# EAGLE design DSP_PID (EAGLE 5.06)
PRICE: 10.00

## Sheet 1 of 2
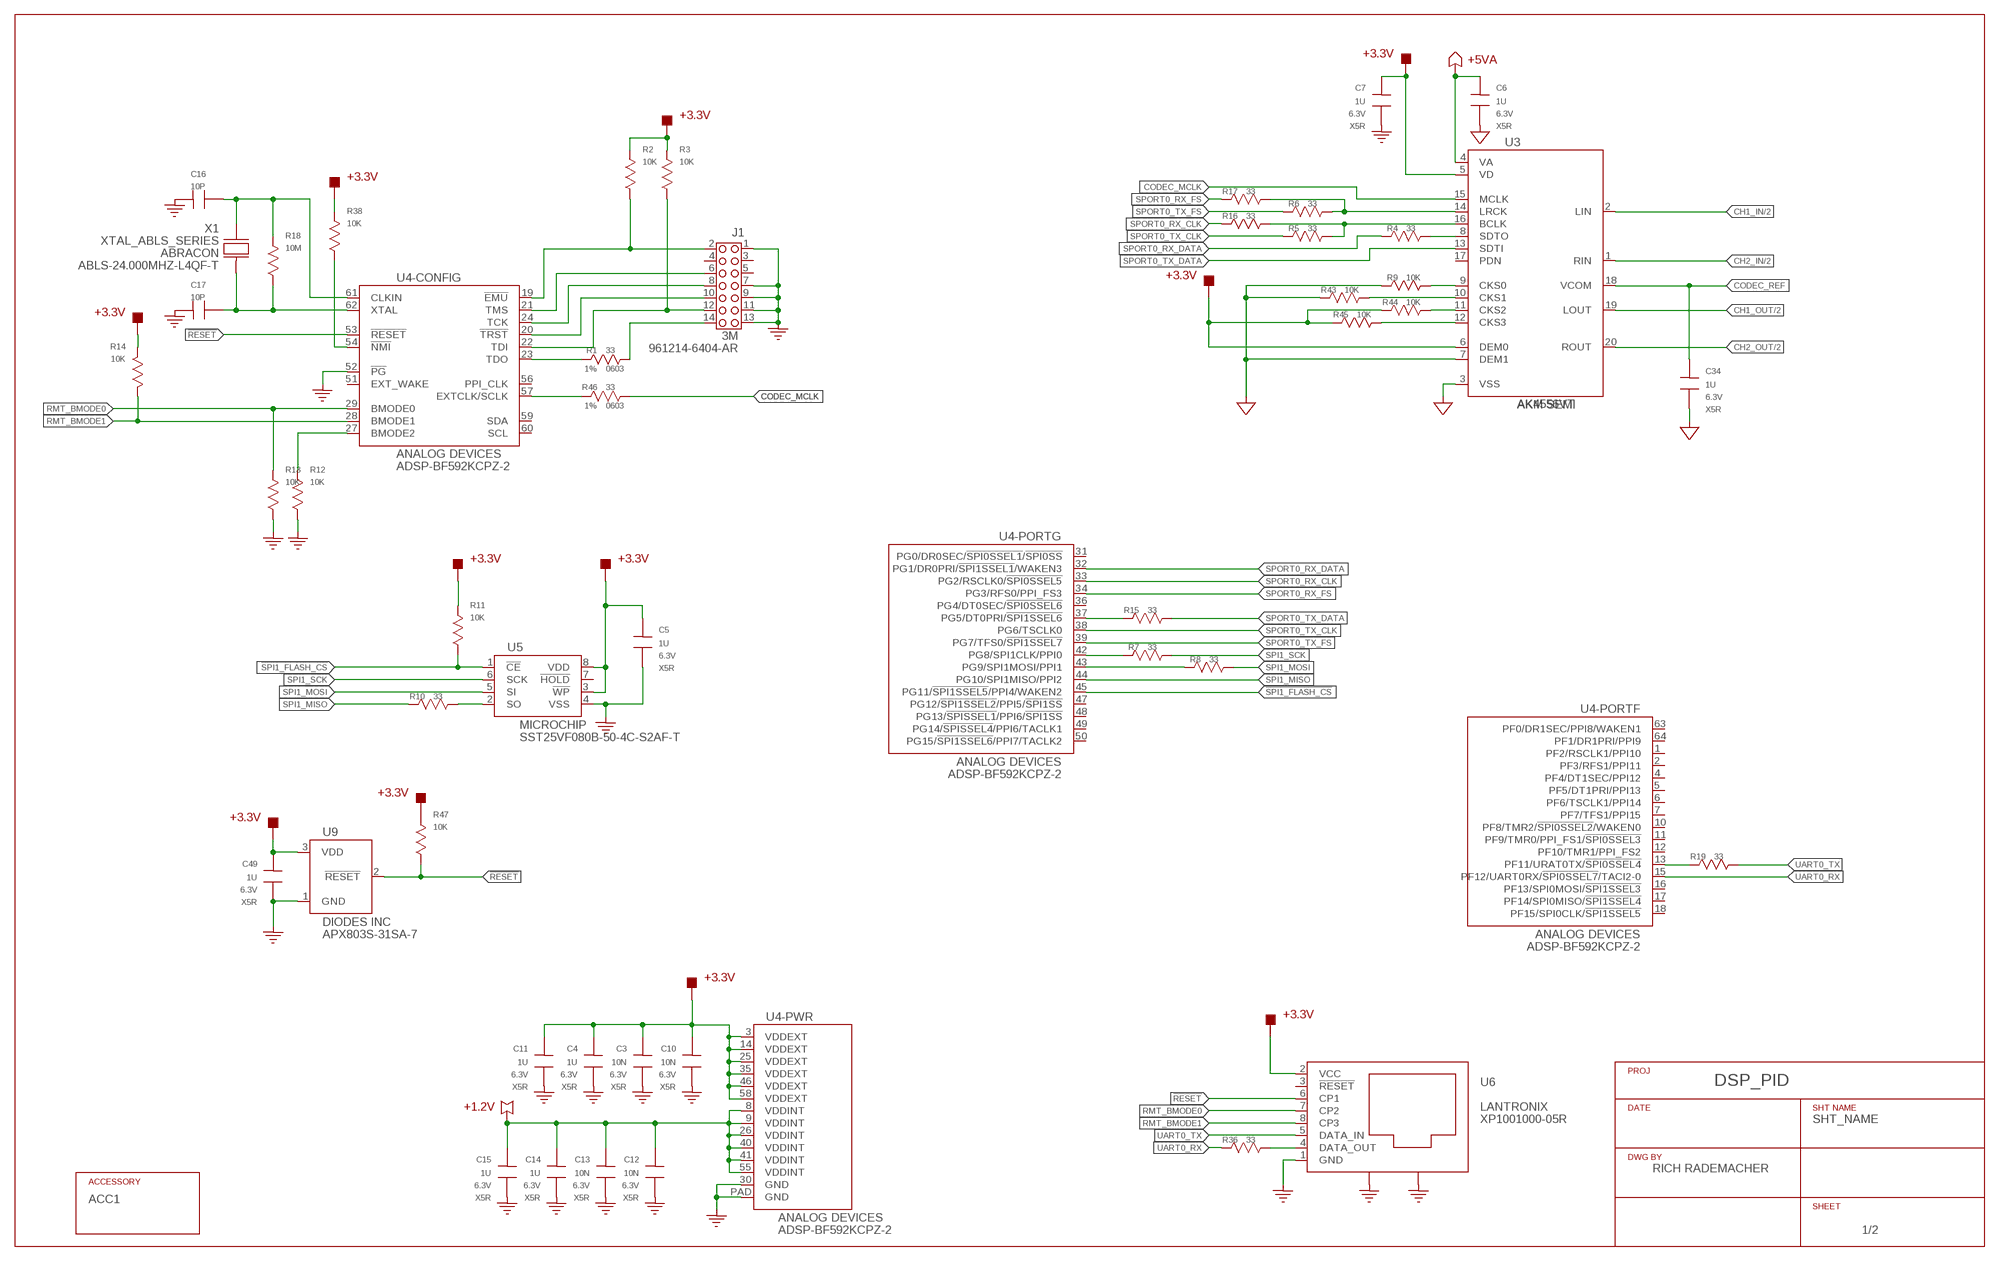
[diagram p0: schematic, sheet 1]
U$1 (TITLEBLOCK): AUTHOR: RICH RADEMACHER; DO_NOT_BOM: TRUE; SHT_NAME: SHT_NAME

### Parts
C3  10N  CAP-NP-0603  [R-0603]
C4  1U  CAP-NP-0603  [R-0603]
C5  1U  CAP-NP-0603  [R-0603]
C6  1U  CAP-NP-0603  [R-0603]
C7  1U  CAP-NP-0603  [R-0603]
C10  10N  CAP-NP-0603  [R-0603]
C11  1U  CAP-NP-0603  [R-0603]
C12  10N  CAP-NP-0603  [R-0603]
C13  10N  CAP-NP-0603  [R-0603]
C14  1U  CAP-NP-0603  [R-0603]
C15  1U  CAP-NP-0603  [R-0603]
C16  10P  CAP-NP-0603  [R-0603]
C17  10P  CAP-NP-0603  [R-0603]
C34  1U  CAP-NP-0603  [R-0603]
C49  1U  CAP-NP-0603  [R-0603]
J1  HDR_2X07X100  [2X07X0.100_HDR]
R1  33  RESISTOR-0603  [R-0603]
R2  10K  RESISTOR-0603  [R-0603]
R3  10K  RESISTOR-0603  [R-0603]
R4  33  RESISTOR-0603  [R-0603]
R5  33  RESISTOR-0603  [R-0603]
R6  33  RESISTOR-0603  [R-0603]
R7  33  RESISTOR-0603  [R-0603]
R8  33  RESISTOR-0603  [R-0603]
R9  10K  RESISTOR-0603  [R-0603]
R10  33  RESISTOR-0603  [R-0603]
R11  10K  RESISTOR-0603  [R-0603]
R12  10K  RESISTOR-0603  [R-0603]
R13  10K  RESISTOR-0603  [R-0603]
R14  10K  RESISTOR-0603  [R-0603]
R15  33  RESISTOR-0603  [R-0603]
R16  33  RESISTOR-0603  [R-0603]
R17  33  RESISTOR-0603  [R-0603]
R18  10M  RESISTOR-0603  [R-0603]
R19  33  RESISTOR-0603  [R-0603]
R36  33  RESISTOR-0603  [R-0603]
R38  10K  RESISTOR-0603  [R-0603]
R43  10K  RESISTOR-0603  [R-0603]
R44  10K  RESISTOR-0603  [R-0603]
R45  10K  RESISTOR-0603  [R-0603]
R46  33  RESISTOR-0603  [R-0603]
R47  10K  RESISTOR-0603  [R-0603]
U3  CODEC_AK4556  [TSSOP-20]
U4  DSP_BF592  [LFCSP-64]
U5  FLASH_SST25VF080B  [SOIC-8]
U6  ETHERNET_LANTRONIX_XPORT  [LANTRONIX-XPORT]
U9  SUPRVISOR-APX803S  [SOT23-3]
X1  XTAL_ABLS_SERIES  [XTAL_ABRACON_ALBS]

### Nets
!RESET: R47.A U4.53(-CONFIG:!RESET) U6.6(CP1) U9.2(!RESET)
!SPI1_FLASH_CS: R11.A U4.45(-PORTG:PG11/!SPI1SSEL5!/PPI4/WAKEN2) U5.1(!CE)
+1.2V: C12.A C13.A C14.A C15.A U4.8(-PWR:VDDINT) U4.9(-PWR:VDDINT) U4.26(-PWR:VDDINT) U4.40(-PWR:VDDINT) U4.41(-PWR:VDDINT) U4.55(-PWR:VDDINT) ; also sheet 2
+3.3V: C3.A C4.A C5.A C7.A C10.A C11.A C49.A R2.B R3.B R11.B R14.B R38.B R44.A R45.A R47.B U3.5(VD) U3.6(DEM0) U4.3(-PWR:VDDEXT) U4.14(-PWR:VDDEXT) U4.25(-PWR:VDDEXT) U4.35(-PWR:VDDEXT) U4.46(-PWR:VDDEXT) U4.58(-PWR:VDDEXT) U5.3(!WP) U5.8(VDD) U6.2(VCC) U9.3(VDD) ; also sheet 2
+5VA: C6.A U3.4(VA) ; also sheet 2
AGND: C6.B C34.B R9.A R43.A U3.3(VSS) U3.7(DEM1) ; also sheet 2
CH1_IN: U3.2(LIN) ; also sheet 2
CH1_OUT: U3.19(LOUT) ; also sheet 2
CH2_IN: U3.1(RIN) ; also sheet 2
CH2_OUT: U3.20(ROUT) ; also sheet 2
CODEC_MCLK: R46.B U3.15(MCLK)
CODEC_REF: C34.A U3.18(VCOM)
GND: C3.B C4.B C5.B C7.B C10.B C11.B C12.B C13.B C14.B C15.B C16.A C17.A C49.B J1.1 J1.7 J1.9 J1.11 J1.13 R12.A R13.A U4.30(-PWR:GND) U4.52(-CONFIG:!PG) U4.PAD(-PWR:GND) U5.4(VSS) U6.1(GND) U6.'SHLD2(SHLD2) U6.SHLD1 U9.1(GND) ; also sheet 2
N$1: J1.2 R2.A U4.19(-CONFIG:!EMU)
N$2: J1.6 U4.21(-CONFIG:TMS)
N$3: J1.8 U4.24(-CONFIG:TCK)
N$4: J1.10 U4.20(-CONFIG:!TRST)
N$5: J1.12 R3.A U4.22(-CONFIG:TDI)
N$6: J1.14 R1.B
N$7: R1.A U4.23(-CONFIG:TDO)
N$8: R5.B R16.B U3.16(BCLK)
N$9: R6.B R17.B U3.14(LRCK)
N$10: R4.B U3.8(SDTO)
N$11: R7.A U4.42(-PORTG:PG8/SPI1CLK/PPI0)
N$12: R8.A U4.43(-PORTG:PG9/SPI1MOSI/PPI1)
N$13: R9.B U3.9(CKS0)
N$14: R12.B U4.27(-CONFIG:BMODE2)
N$15: R10.B U5.2(SO)
N$16: R43.B U3.10(CKS1)
N$17: R45.B U3.12(CKS3)
N$18: R15.A U4.37(-PORTG:PG5/DT0PRI/!SPI1SSEL6)
N$22: C17.B R18.A U4.62(-CONFIG:XTAL) X1.B
N$25: C16.B R18.B U4.61(-CONFIG:CLKIN) X1.A
N$27: R19.A U4.13(-PORTF:PF11/URAT0TX/!SPI0SSEL4)
N$35: R38.A U4.54(-CONFIG:!NMI)
N$41: R36.B U6.4(DATA_OUT)
N$52: R44.B U3.11(CKS2)
N$58: R46.A U4.57(-CONFIG:EXTCLK/SCLK)
RMT_BMODE0: R13.B U4.29(-CONFIG:BMODE0) U6.7(CP2)
RMT_BMODE1: R14.A U4.28(-CONFIG:BMODE1) U6.8(CP3)
SPI1_MISO: R10.A U4.44(-PORTG:PG10/SPI1MISO/PPI2)
SPI1_MOSI: R8.B U5.5(SI)
SPI1_SCK: R7.B U5.6(SCK)
SPORT0_RX_CLK: R16.A U4.33(-PORTG:PG2/RSCLK0/!SPI0SSEL5)
SPORT0_RX_DATA: R4.A U4.32(-PORTG:PG1/DR0PRI/!SPI1SSEL1!/WAKEN3)
SPORT0_RX_FS: R17.A U4.34(-PORTG:PG3/RFS0/PPI_FS3)
SPORT0_TX_CLK: R5.A U4.38(-PORTG:PG6/TSCLK0)
SPORT0_TX_DATA: R15.B U3.13(SDTI)
SPORT0_TX_FS: R6.A U4.39(-PORTG:PG7/TFS0/!SPI1SSEL7)
UART0_RX: R36.A U4.15(-PORTF:PF12/UART0RX/!SPI0SSEL7!/TACI2-0)
UART0_TX: R19.B U6.5(DATA_IN)
Unconnected: J1.3 J1.4 J1.5 U3.17(PDN) U4.1(-PORTF:PF2/RSCLK1/PPI10) U4.2(-PORTF:PF3/RFS1/PPI11) U4.4(-PORTF:PF4/DT1SEC/PPI12) U4.5(-PORTF:PF5/DT1PRI/PPI13) U4.6(-PORTF:PF6/TSCLK1/PPI14) U4.7(-PORTF:PF7/TFS1/PPI15) U4.10(-PORTF:PF8/TMR2/!SPI0SSEL2!/WAKEN0) U4.11(-PORTF:PF9/TMR0/PPI_FS1/!SPI0SSEL3) U4.12(-PORTF:PF10/TMR1/PPI_FS2) U4.16(-PORTF:PF13/SPI0MOSI/!SPI1SSEL3) U4.17(-PORTF:PF14/SPI0MISO/!SPI1SSEL4) U4.18(-PORTF:PF15/SPI0CLK/!SPI1SSEL5) U4.31(-PORTG:PG0/DR0SEC/!SPI0SSEL1!/!SPI0SS) U4.36(-PORTG:PG4/DT0SEC/!SPI0SSEL6) U4.47(-PORTG:PG12/!SPI1SSEL2!/PPI5/!SPI1SS) U4.48(-PORTG:PG13/!SPISSEL1!/PPI6/!SPI1SS) U4.49(-PORTG:PG14/!SPISSEL4!/PPI6/TACLK1) U4.50(-PORTG:PG15/!SPI1SSEL6!/PPI7/TACLK2) U4.51(-CONFIG:EXT_WAKE) U4.56(-CONFIG:PPI_CLK) U4.59(-CONFIG:SDA) U4.60(-CONFIG:SCL) U4.63(-PORTF:PF0/DR1SEC/PPI8/WAKEN1) U4.64(-PORTF:PF1/DR1PRI/PPI9) U5.7(!HOLD) U6.3(!RESET)

## Sheet 2 of 2
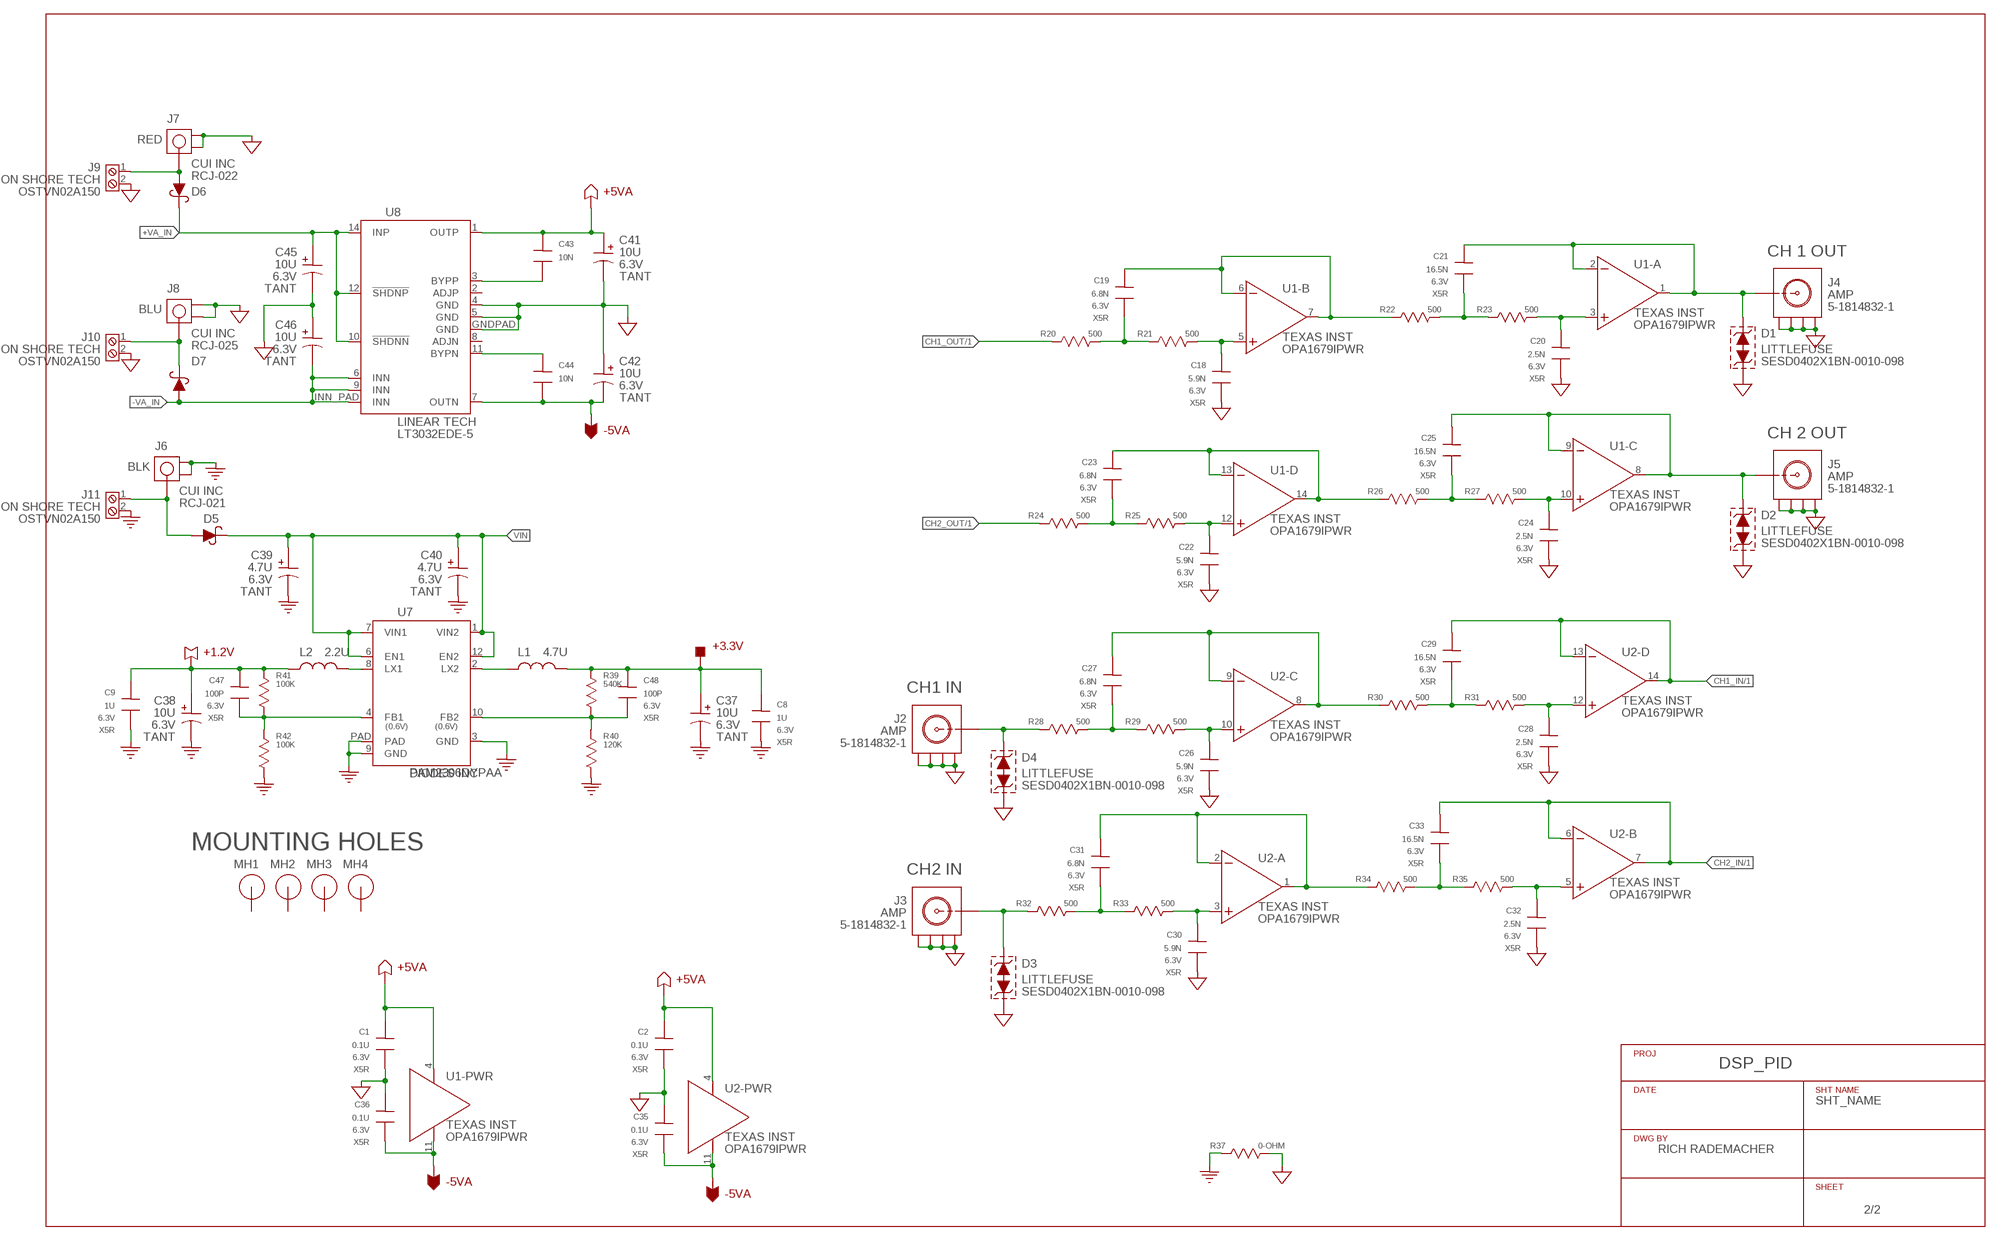
[diagram p1: schematic, sheet 2]
U$2 (TITLEBLOCK): AUTHOR: RICH RADEMACHER; DO_NOT_BOM: TRUE; SHT_NAME: SHT_NAME

### Parts
C1  0.1U  CAP-NP-0603  [R-0603]
C2  0.1U  CAP-NP-0603  [R-0603]
C8  1U  CAP-NP-0603  [R-0603]
C9  1U  CAP-NP-0603  [R-0603]
C18  5.9N  CAP-NP-0603  [R-0603]
C19  6.8N  CAP-NP-0603  [R-0603]
C20  2.5N  CAP-NP-0603  [R-0603]
C21  16.5N  CAP-NP-0603  [R-0603]
C22  5.9N  CAP-NP-0603  [R-0603]
C23  6.8N  CAP-NP-0603  [R-0603]
C24  2.5N  CAP-NP-0603  [R-0603]
C25  16.5N  CAP-NP-0603  [R-0603]
C26  5.9N  CAP-NP-0603  [R-0603]
C27  6.8N  CAP-NP-0603  [R-0603]
C28  2.5N  CAP-NP-0603  [R-0603]
C29  16.5N  CAP-NP-0603  [R-0603]
C30  5.9N  CAP-NP-0603  [R-0603]
C31  6.8N  CAP-NP-0603  [R-0603]
C32  2.5N  CAP-NP-0603  [R-0603]
C33  16.5N  CAP-NP-0603  [R-0603]
C35  0.1U  CAP-NP-0603  [R-0603]
C36  0.1U  CAP-NP-0603  [R-0603]
C37  10U  CAP-POL-SIZEA  [CAP-SIZEA-1206]
C38  10U  CAP-POL-SIZEA  [CAP-SIZEA-1206]
C39  4.7U  CAP-POL-SIZEA  [CAP-SIZEA-1206]
C40  4.7U  CAP-POL-SIZEA  [CAP-SIZEA-1206]
C41  10U  CAP-POL-SIZEA  [CAP-SIZEA-1206]
C42  10U  CAP-POL-SIZEA  [CAP-SIZEA-1206]
C43  10N  CAP-NP-0603  [R-0603]
C44  10N  CAP-NP-0603  [R-0603]
C45  10U  CAP-POL-SIZEA  [CAP-SIZEA-1206]
C46  10U  CAP-POL-SIZEA  [CAP-SIZEA-1206]
C47  100P  CAP-NP-0603  [R-0603]
C48  100P  CAP-NP-0603  [R-0603]
D1  TVS_SESD0402  [0402-DFN]
D2  TVS_SESD0402  [0402-DFN]
D3  TVS_SESD0402  [0402-DFN]
D4  TVS_SESD0402  [0402-DFN]
D5  SCHOTTKY_SS2P4  [DO-220AA]
D6  SCHOTTKY_SS2P4  [DO-220AA]
D7  SCHOTTKY_SS2P4  [DO-220AA]
J2  CONN_SMA_VERT  [CONN_SMB_GND]
J3  CONN_SMA_VERT  [CONN_SMB_GND]
J4  CONN_SMA_VERT  [CONN_SMB_GND]
J5  CONN_SMA_VERT  [CONN_SMB_GND]
J6  CONN_RCA-BLACK-BLK  [CUI_RCJ-02X]
J7  CONN_RCA-RED-BLK  [CUI_RCJ-02X]
J8  CONN_RCA-BLU-BLK  [CUI_RCJ-02X]
J9  CONN_SCREWTERM_2.54MM_2POS  [OST_SCREWTERM_2.54MM_2POS]
J10  CONN_SCREWTERM_2.54MM_2POS  [OST_SCREWTERM_2.54MM_2POS]
J11  CONN_SCREWTERM_2.54MM_2POS  [OST_SCREWTERM_2.54MM_2POS]
L1  4.7U  INDUCTOR-1206  [L-1206]
L2  2.2U  INDUCTOR-1206  [L-1206]
MH1  MTG-HOLE  [MTG-4-40]
MH2  MTG-HOLE  [MTG-4-40]
MH3  MTG-HOLE  [MTG-4-40]
MH4  MTG-HOLE  [MTG-4-40]
R20  500  RESISTOR-0603  [R-0603]
R21  500  RESISTOR-0603  [R-0603]
R22  500  RESISTOR-0603  [R-0603]
R23  500  RESISTOR-0603  [R-0603]
R24  500  RESISTOR-0603  [R-0603]
R25  500  RESISTOR-0603  [R-0603]
R26  500  RESISTOR-0603  [R-0603]
R27  500  RESISTOR-0603  [R-0603]
R28  500  RESISTOR-0603  [R-0603]
R29  500  RESISTOR-0603  [R-0603]
R30  500  RESISTOR-0603  [R-0603]
R31  500  RESISTOR-0603  [R-0603]
R32  500  RESISTOR-0603  [R-0603]
R33  500  RESISTOR-0603  [R-0603]
R34  500  RESISTOR-0603  [R-0603]
R35  500  RESISTOR-0603  [R-0603]
R37  0-OHM  RESISTOR-1206  [R-1206]
R39  540K  RESISTOR-0603  [R-0603]
R40  120K  RESISTOR-0603  [R-0603]
R41  100K  RESISTOR-0603  [R-0603]
R42  100K  RESISTOR-0603  [R-0603]
U1  AMP_OPA1679  [TSSOP-14]
U2  AMP_OPA1679  [TSSOP-14]
U7  REG_PAM2306D  [WDFN-12]
U8  REG_LT3032  [DFN-14_SPLITPAD]

### Nets
+1.2V: C9.A C38.P(+) C47.A L2.A R41.B ; also sheet 1
+3.3V: C8.A C37.P(+) C48.A L1.B R39.B ; also sheet 1
+5VA: C1.A C2.A C41.P(+) C43.A U1.4(-PWR:V+) U2.4(-PWR:V+) U8.1(OUTP) ; also sheet 1
+VA_IN: C45.P(+) D6.K U8.10(!SHDNN) U8.12(!SHDNP) U8.14(INP)
-5VA: C35.B C36.B C42.N(-) C44.B U1.11(-PWR:V-) U2.11(-PWR:V-) U8.7(OUTN)
-VA_IN: C46.N(-) D7.A U8.6(INN) U8.9(INN) U8.INN_PAD(INN)
AGND: C1.B C2.B C18.B C20.B C22.B C24.B C26.B C28.B C30.B C32.B C35.A C36.A C41.N(-) C42.P(+) C45.N(-) C46.P(+) D1.2 D2.2 D3.2 D4.2 J2.P$1(GND) J2.P$2(GND) J2.P$3(GND) J2.P$4(GND) J3.P$1(GND) J3.P$2(GND) J3.P$3(GND) J3.P$4(GND) J4.P$1(GND) J4.P$2(GND) J4.P$3(GND) J4.P$4(GND) J5.P$1(GND) J5.P$2(GND) J5.P$3(GND) J5.P$4(GND) J7.GND@1 J7.GND@2 J8.GND@1 J8.GND@2 J9.2 J10.2 R37.B U8.4(GND) U8.5(GND) U8.GNDPAD(GND) ; also sheet 1
CH1_IN: C29.A U2.13(-D:-) U2.14(-D:OUT) ; also sheet 1
CH1_OUT: R20.A ; also sheet 1
CH2_IN: C33.A U2.6(-B:-) U2.7(-B:OUT) ; also sheet 1
CH2_OUT: R24.A ; also sheet 1
GND: C8.B C9.B C37.N(-) C38.N(-) C39.N(-) C40.N(-) J6.GND@1 J6.GND@2 J11.2 R37.A R40.A R42.A U7.3(GND) U7.9(GND) U7.PAD ; also sheet 1
N$19: C19.A R22.A U1.6(-B:-) U1.7(-B:OUT)
N$20: C18.A R21.B U1.5(-B:+)
N$21: C19.B R20.B R21.A
N$23: C21.A D1.1 J4.PIN U1.1(-A:OUT) U1.2(-A:-)
N$24: D5.A J6.PIN J11.1
N$26: C20.A R23.B U1.3(-A:+)
N$28: C21.B R22.B R23.A
N$29: C23.B R24.B R25.A
N$30: C23.A R26.A U1.13(-D:-) U1.14(-D:OUT)
N$31: C22.A R25.B U1.12(-D:+)
N$32: C25.B R26.B R27.A
N$33: C24.A R27.B U1.10(-C:+)
N$34: C25.A D2.1 J5.PIN U1.8(-C:OUT) U1.9(-C:-)
N$36: C27.A R30.A U2.8(-C:OUT) U2.9(-C:-)
N$37: C26.A R29.B U2.10(-C:+)
N$38: C27.B R28.B R29.A
N$39: C28.A R31.B U2.12(-D:+)
N$40: C29.B R30.B R31.A
N$42: C31.B R32.B R33.A
N$43: C31.A R34.A U2.1(-A:OUT) U2.2(-A:-)
N$44: C30.A R33.B U2.3(-A:+)
N$45: C33.B R34.B R35.A
N$46: C47.B R41.A R42.B U7.4(FB1)
N$47: C32.A R35.B U2.5(-B:+)
N$48: C48.B R39.A R40.B U7.10(FB2)
N$49: L1.A U7.2(LX2)
N$50: D4.1 J2.PIN R28.A
N$51: D3.1 J3.PIN R32.A
N$53: C44.A U8.11(BYPN)
N$54: L2.B U7.8(LX1)
N$55: C43.B U8.3(BYPP)
N$56: D6.A J7.PIN J9.1
N$57: D7.K J8.PIN J10.1
VIN: C39.P(+) C40.P(+) D5.K U7.1(VIN2) U7.6(EN1) U7.7(VIN1) U7.12(EN2)
Unconnected: MH1.P$1 MH2.P$1 MH3.P$1 MH4.P$1 U8.2(ADJP) U8.8(ADJN)

### Notes on the sheet
- CH 1 OUT
- CH 2 OUT
- CH1 IN
- MOUNTING HOLES
- CH2 IN

## Library data of the parts
C1-C36 C43 C44 C47-C49 = DSP_PID:CAP-NP; COST: 0.074; DIELECTRIC: X5R; SOLIDMODEL: CAP_NP_0603.g; SOLIDWORKS_CONFIG: SIZE_0603; SOLIDWORKS_FILE: ChipCapacitor.SLDASM; VOLTAGE: 6.3V
C37-C42 C45 C46 = DSP_PID:CAP-POL; COST: 0.80; DIELECTRIC: TANT; MFG: AVX; MPN: TAJA-SERIES; SOLIDMODEL: CAP_TANT_SIZE_A.g; SOLIDWORKS_CONFIG: SIZE_A; SOLIDWORKS_FILE: TantalumCap.SLDASM; VENDOR: DIGIKEY; VOLTAGE: 6.3V
D1-D4 = DSP_PID:TVS_SESD0402: TVS DIODE 7VWM 10VC DFN, 0.1pF @ 3GHz; MFG: LITTLEFUSE; MPN: SESD0402X1BN-0010-098; PRICE: 0.68; VENDOR: DIGIKEY; VPN: SESD0402X1BN-0010-098CT-ND
D5-D7 = DSP_PID:SCHOTTKY_SS2P4: DIODE, SCHOTTKY, 40V, 2A; COST: 0.39; MFG: VISHAY; MPN: SS2P4-E3; VENDOR: DIGIKEY; VPN: SS2P4-E3/A8AICT-ND
J1 = DSP_PID:HDR_2X07X100; MFG: 3M; MPN: 961214-6404-AR; PRICE: 1.66; VENDOR: DIGIKEY; VPN: 3M9466-14-ND
J2-J5 = DSP_PID:CONN_SMA_VERT: CONN SMA JACK STR 50 OHM PCB; MFG: AMP; MPN: 5-1814832-1; PRICE: 1.94; VENDOR: DIGIKEY; VPN: A97594-ND
J6 = DSP_PID:CONN_RCA: VERTICAL THROUGH HOLE RCA JACK FEMALE; COLOR: BLK; MFG: CUI INC; MPN: RCJ-021; PRICE: 0.88; VENDOR: DIGIKEY; VPN: CP-1406-ND
J7 = DSP_PID:CONN_RCA: VERTICAL THROUGH HOLE RCA JACK FEMALE; COLOR: RED; MFG: CUI INC; MPN: RCJ-022; PRICE: 0.88; VENDOR: DIGIKEY; VPN: CP-1407-ND
J8 = DSP_PID:CONN_RCA: VERTICAL THROUGH HOLE RCA JACK FEMALE; COLOR: BLU; MFG: CUI INC; MPN: RCJ-025; PRICE: 0.88; VENDOR: DIGIKEY; VPN: CP-1410-ND
J9-J11 = DSP_PID:CONN_SCREWTERM_2.54MM_2POS: CONN TERM BLOCK 2.54MM 2POS PCB; MFG: ON SHORE TECH; MPN: OSTVN02A150; PRICE: 1.24; VENDOR: DIGIKEY; VPN: ED10561-ND
L1 L2 = DSP_PID:INDUCTOR: 0805HT (2012) Ceramic Chip Inductors Our lowest profile 0805 chip inductors only 0.035" high! Inductance values from 1.8 nH to 150 nH (tolerances as low as 5%) Exceptionally high Q compared to non-wirewound inductors, especially at high frequencies Ceramic construction for highest possible self resonance (up to 11,500 MHz) RoHS Compliant. 260°C compatible. Silver-palladium-platinum-glass frit terminations. COTS Plus tin-silver-copper and tin-lead terminations available Samples of most 5% parts are available in Coilcraft Designer's Kit C321; SIZE: 1206
MH1-MH4 = DSP_PID:MTG-HOLE; DO_NOT_BOM: TRUE
R1-R36 R38-R47 = DSP_PID:RESISTOR; PACKAGE: 0603; PRICE: .059; SOLIDMODEL: res0603.g; SOLIDWORKS_CONFIG: SIZE_0603; SOLIDWORKS_FILE: ChipResistor.SLDASM; TOLERANCE: 1%
R37 = DSP_PID:RESISTOR; PACKAGE: 1206; PRICE: .03; SOLIDMODEL: res1206.g; SOLIDWORKS_CONFIG: SIZE_01206; SOLIDWORKS_FILE: ChipResistor.SLDASM; TOLERANCE: 1%
U1 U2 = DSP_PID:AMP_OPA1679: Quad Low-Distortion Audio Operational Amplifiers, +/-18v, 4.5nV/rtHz; MFG: TEXAS INST; MPN: OPA1679IPWR; VENDOR: DIGIKEY; VPN: OPA1679IPWR-ND
U3 = DSP_PID:CODEC_AK4556: 3V 192KHZ STEREO AUDIO CODEC; MFG: AKM SEMI; MPN: AK4556VT; PRICE: 5.45; VENDOR: DIGIKEY; VPN: 974-1021-1-ND
U4 = DSP_PID:DSP_BF592: Blackfin 200MHz Digital Signal Processor, 64-PIN LCSP; MFG: ANALOG DEVICES; MPN: ADSP-BF592KCPZ-2; PRICE: 6.25; SOLIDWORKS_CONFIG: LFCSP-64; SOLIDWORKS_FILE: LFCSP.SLDASM; VENDOR: DIGIKEY; VPN: ADSP-BF592KCPZ-2-ND
U5 = DSP_PID:FLASH_SST25VF080B: 8 Mbit SPI Serial Flash; MFG: MICROCHIP; MPN: SST25VF080B-50-4C-S2AF-T; PRICE: 1.83; VENDOR: DIGIKEY; VPN: SST25VF080B-50-4C-S2AF-T-ND
U6 = DSP_PID:ETHERNET_LANTRONIX_XPORT: 3.3V SERIAL TO ETHERNET WITHIN RJ45 JACK, 224mA@88MHz, 112mA@48MHz; MFG: LANTRONIX; MPN: XP1001000-05R; PRICE: 45.88000; VENDOR: DIGIKEY; VPN: 1829-1000-ND
U7 = DSP_PID:REG_PAM2306D: DUAL 1-A HIGH-EFFICIENCY PWM STEP-DOWN DC-DC CONVERTER; MFG: DIODES INC; MPN: PAM2306DYPAA; PRICE: 0.73; VENDOR: DIGIKEY; VPN: PAM2306DYPAADICT-ND
U8 = DSP_PID:REG_LT3032: +/-5V Dual 150mA Positive/Negative Low Noise Low Dropout Linear Regulator; MFG: LINEAR TECH; MPN: LT3032EDE-5; PRICE: 4.79; VENDOR: DIGIKEY; VPN: LT3032EDE-5#PBF-ND
U9 = DSP_PID:SUPRVISOR-APX803S: 3-PIN MICROPROCESSOR RESET CIRCUIT; MFG: DIODES INC; MPN: APX803S-31SA-7; PRICE: 0.53; VENDOR: DIGIKEY; VPN: APX803S-31SA-7DICT-ND
X1 = DSP_PID:XTAL_ABLS_SERIES: CRYSTAL, 12MHZ X 18PF; MFG: ABRACON; MPN: ABLS-24.000MHZ-L4QF-T; PRICE: 0.76; VALUE: 12 MHz; VENDOR: DIGIKEY; VPN: 535-9918-1-ND

## Board
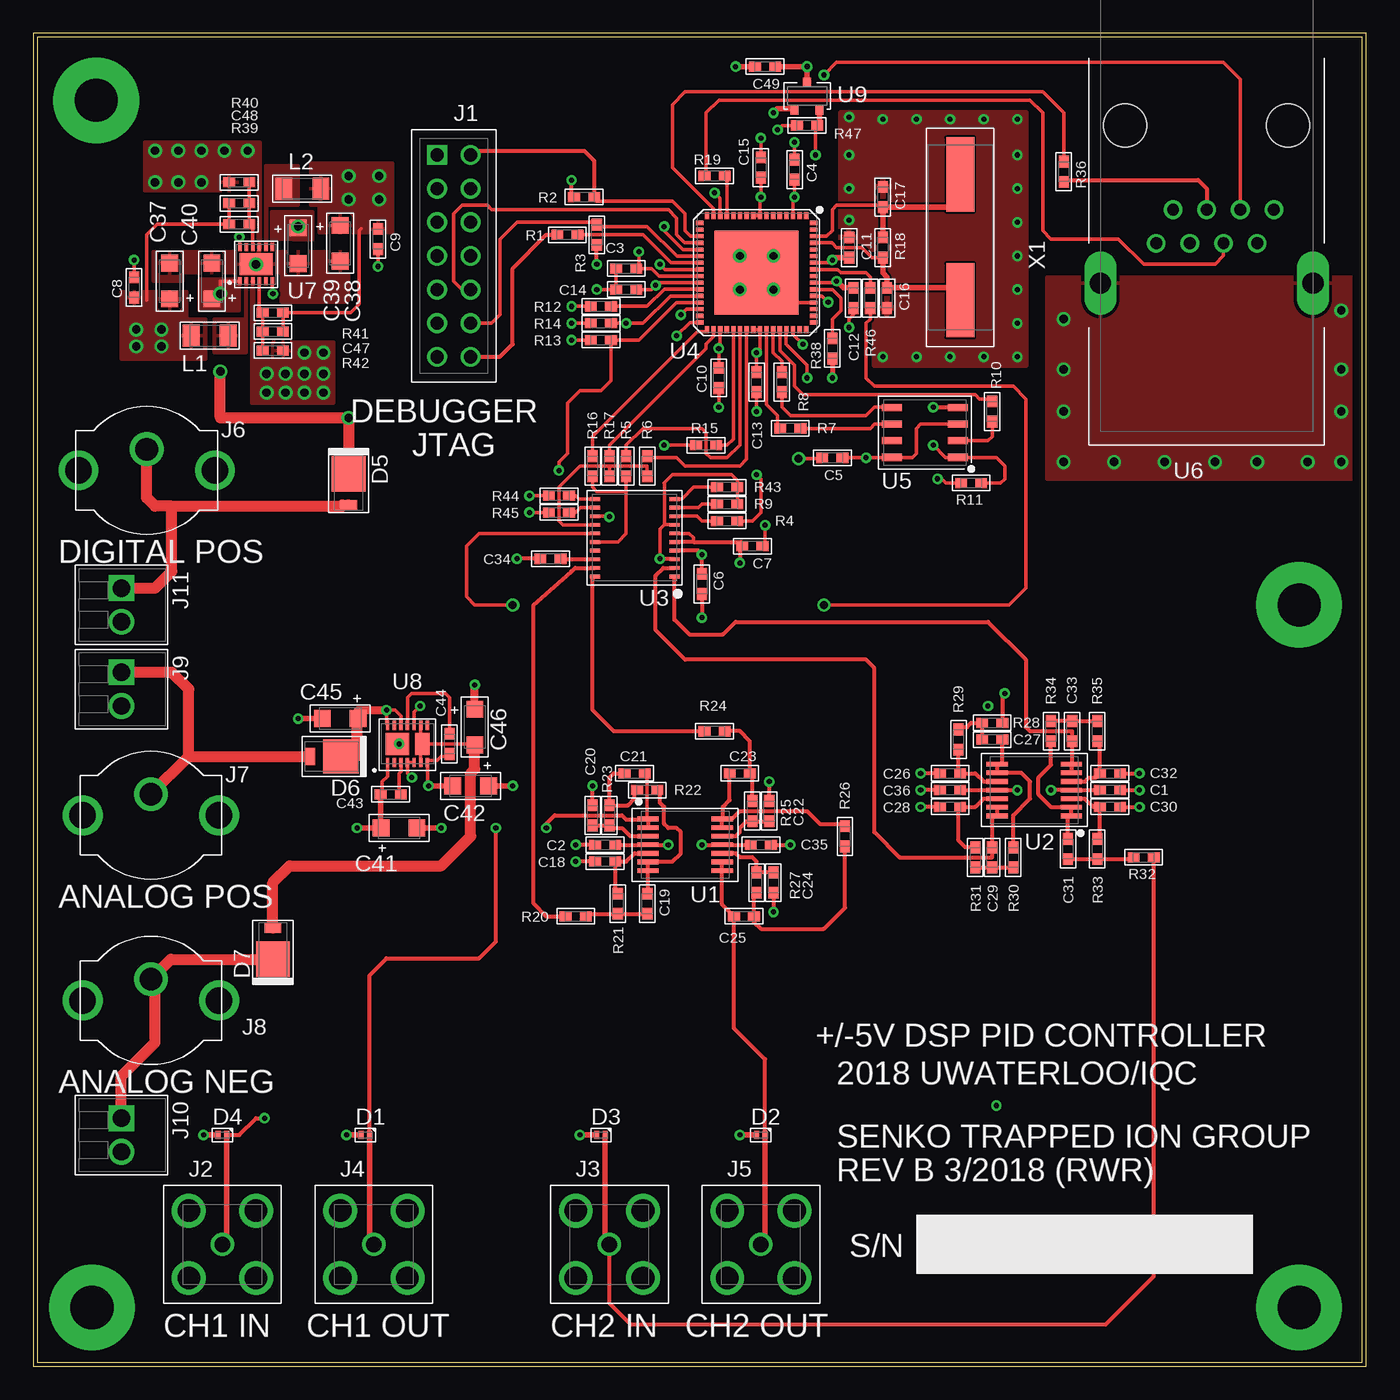
[diagram p2: board, top side]
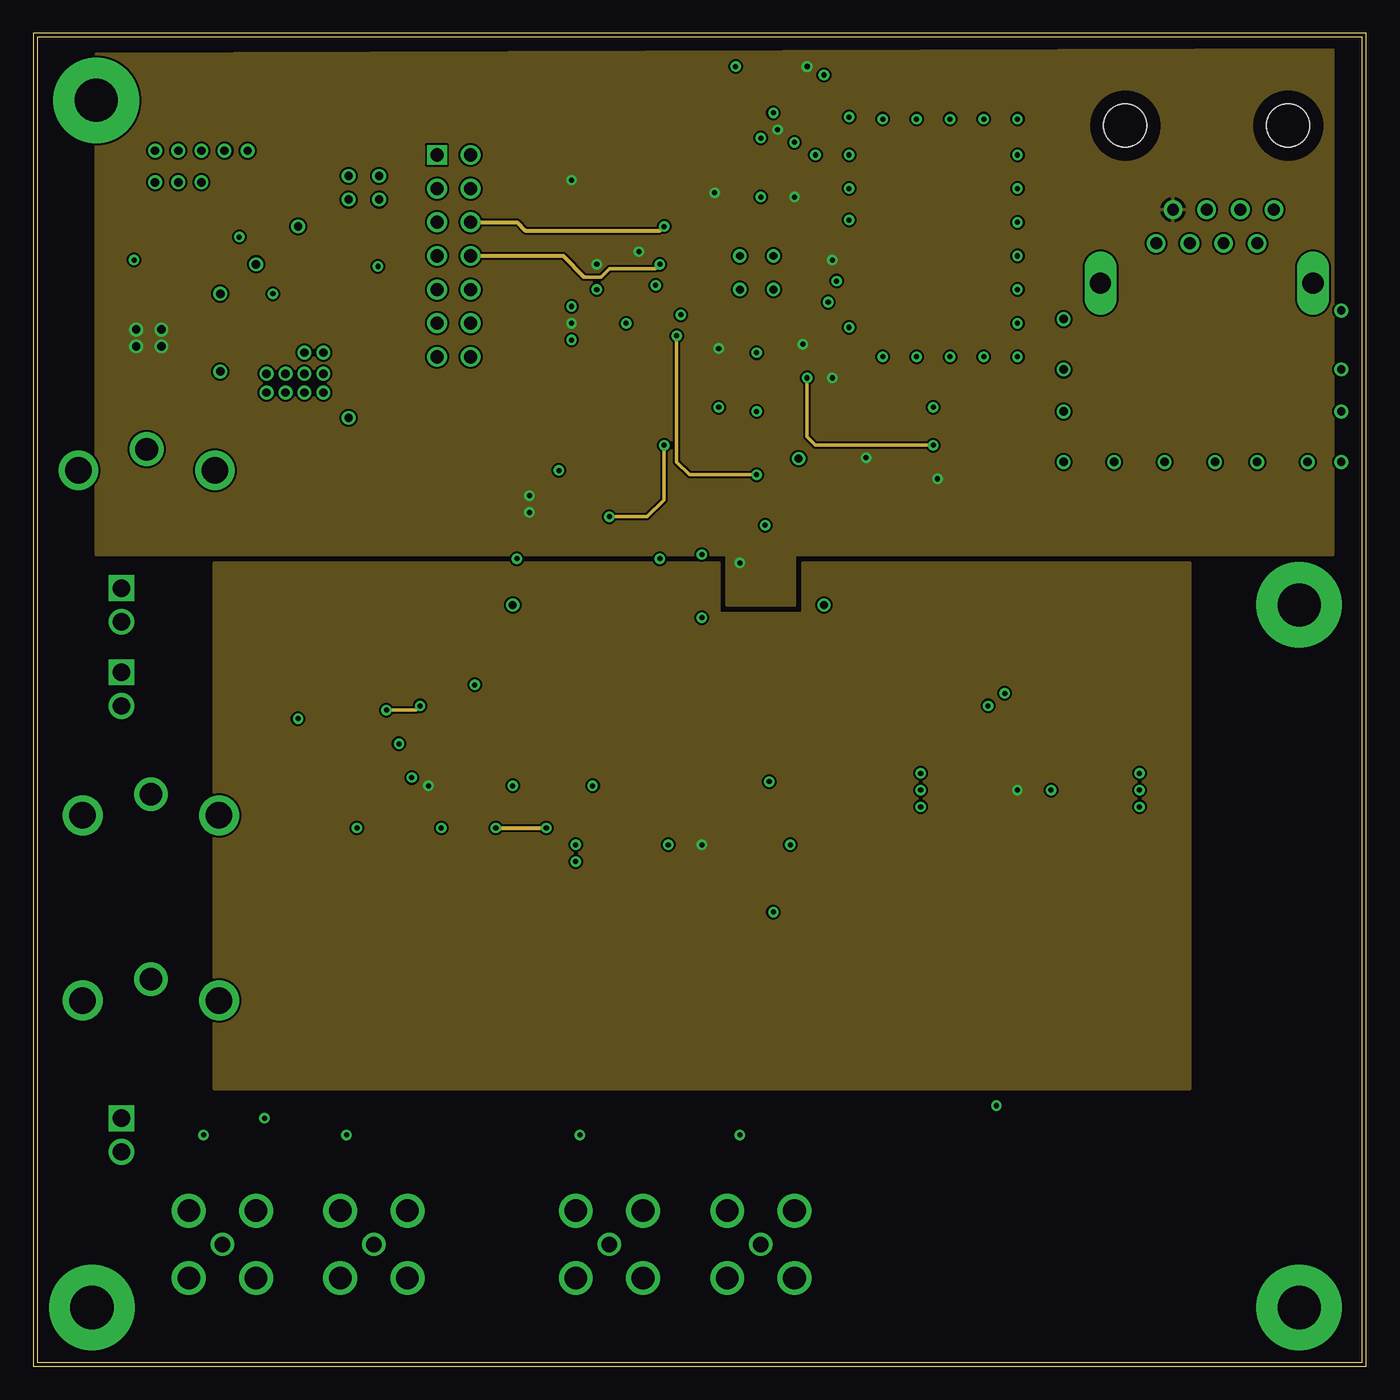
[diagram p3: board, inner layer Route2]
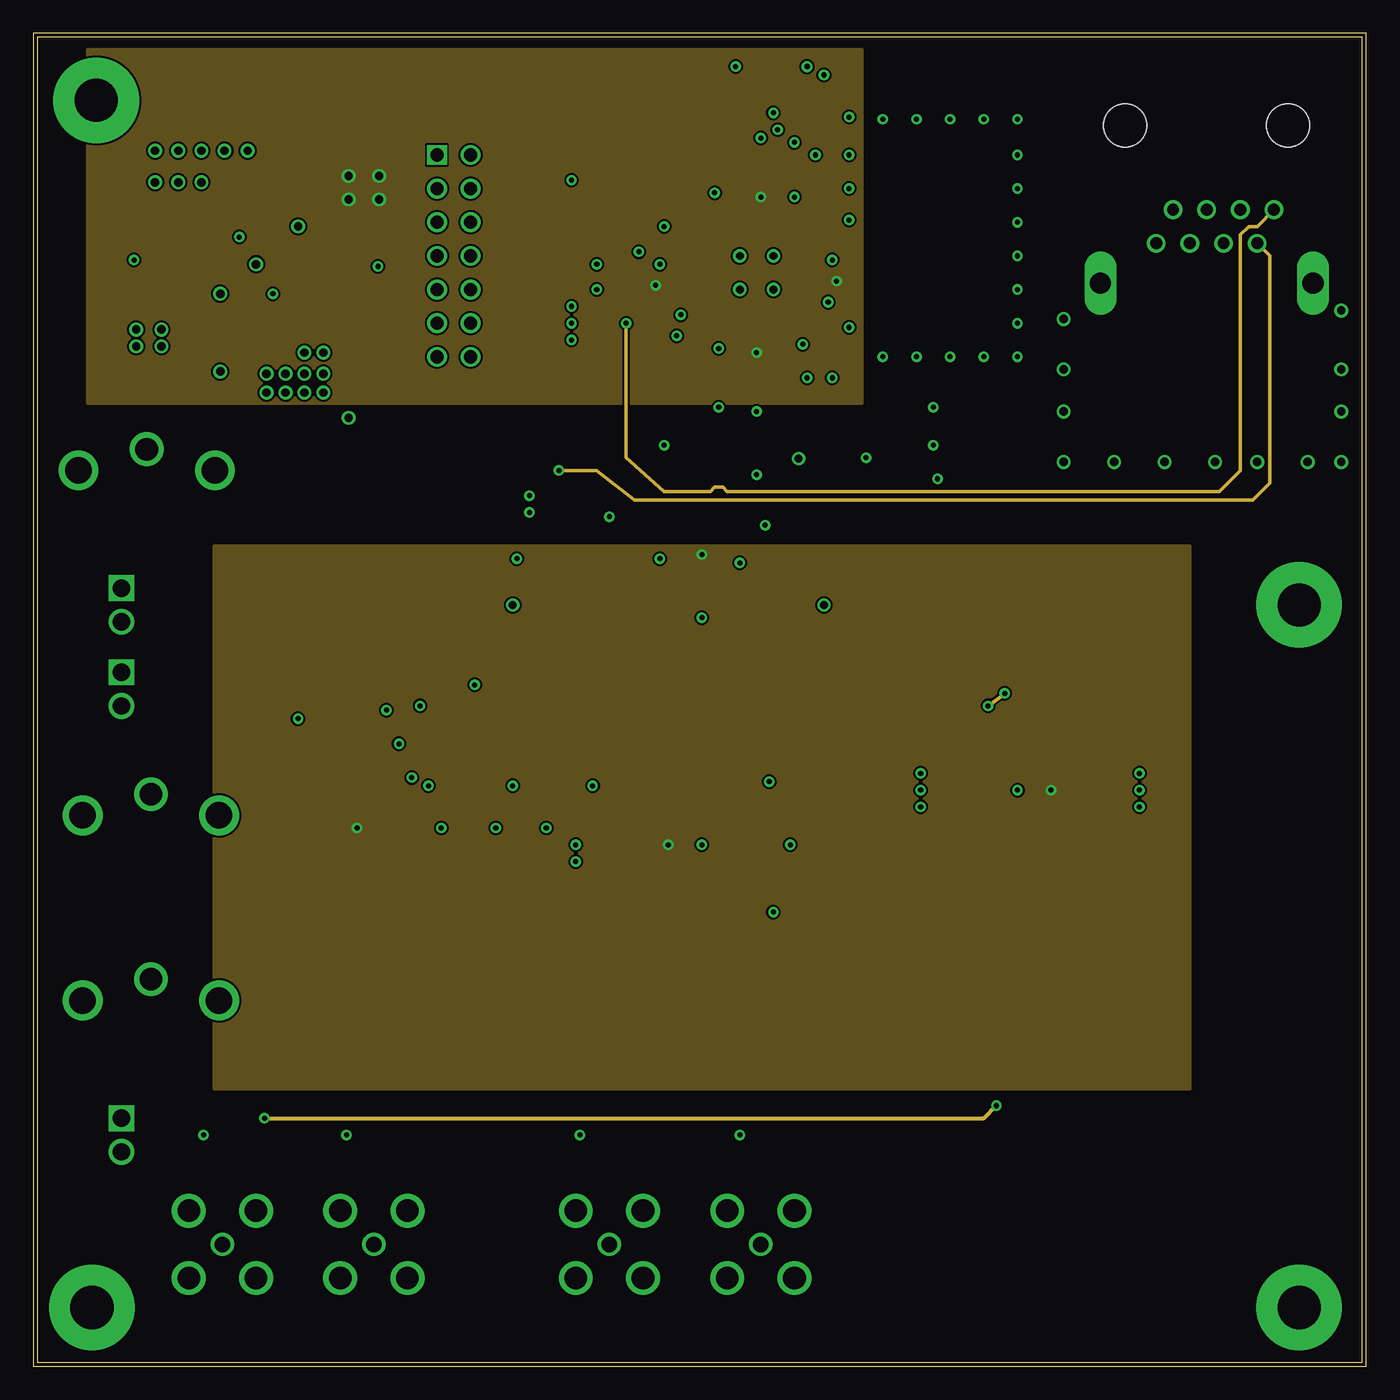
[diagram p4: board, inner layer Route15]
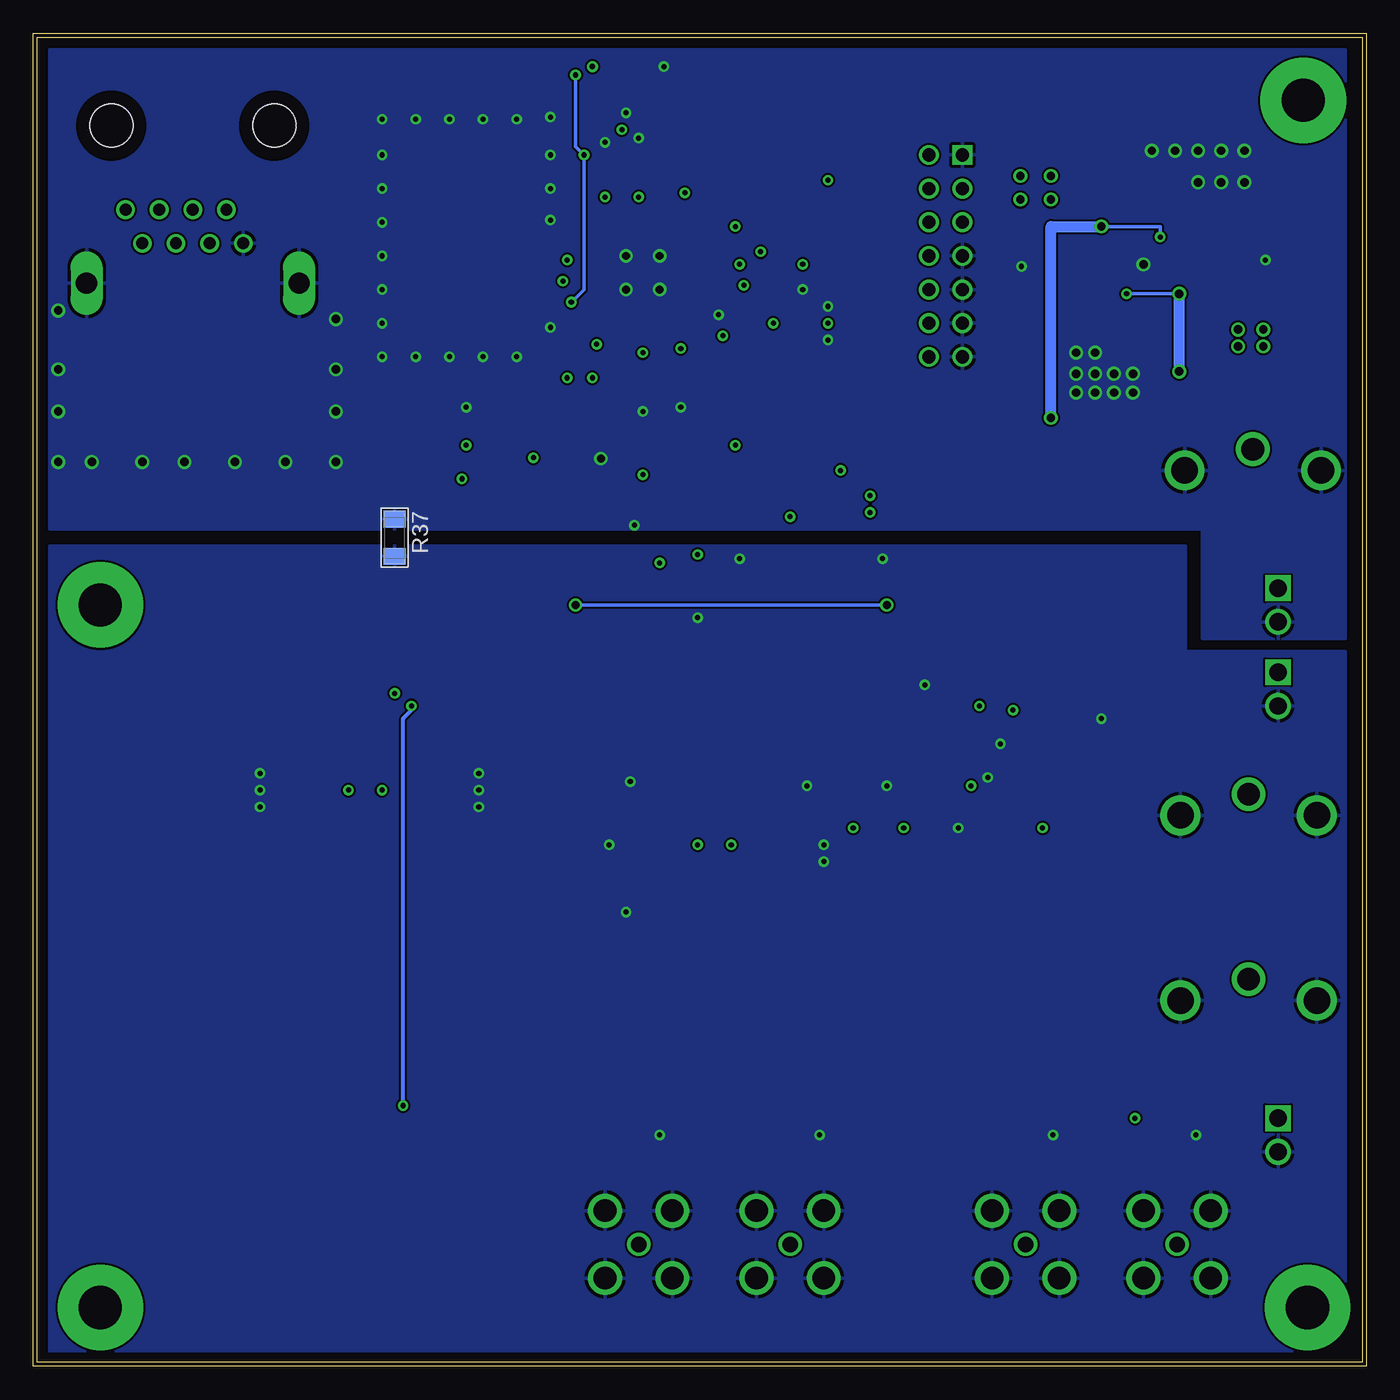
[diagram p5: board, bottom side, seen from below]

Size 100.63 x 100.63 mm. Coordinates in mm from the lower left corner, seen from the top.
Outline: 0,0 100.63,0 100.63,100.63 0,100.63 0,0
Copper layers (1*2+15*16): Top 0.035mm / dielectric 1.5mm / Route2 0.035mm / dielectric 0.15mm / Route15 0.035mm / dielectric 0.2mm / Bottom 0.035mm
Design rules "default *": minimum track width 10mil, minimum drill 12mil, track to track 6mil, track to pad 6mil, pad to pad 6mil, via to via 6mil, smd to smd 6mil, copper to edge 40mil, drill to drill 8mil, minimum pad ring 10mil, minimum via ring 8mil, stop-mask expansion 4mil, vias tented up to drill 0mil, thermal gap 10mil
Milling: 4 lines

### Footprints (pad centres in the part's own frame; a part is rotated, then mirrored left to right if it is on the bottom)
R-0603 = smd 0.889 x 0.762: A -0.762,0; B 0.762,0
CAP-SIZEA-1206 = smd 1.27 x 1.27: N 0,-1.346; P 0,1.346
0402-DFN = smd 0.61 x 0.356: 1 0,0.318; 2 0,-0.318
DO-220AA = smd 0.762 x 1.27: A 1.016,0 | smd 2.667 x 2.54: K -1.333,0
2X07X0.100_HDR = drill 0.991 square: 1 0,-2.54 | drill 0.991 round: 2 0,0; 3 2.54,-2.54; 4 2.54,0; 5 5.08,-2.54; 6 5.08,0; 7 7.62,-2.54; 8 7.62,0; 9 10.16,-2.54; 10 10.16,0; 11 12.7,-2.54; 12 12.7,0; 13 15.24,-2.54; 14 15.24,0
CONN_SMB_GND = drill 1.702 round: P$1 -2.54,-2.54; P$2 -2.54,2.54; P$3 2.54,2.54; P$4 2.54,-2.54 | drill 1.168 round: PIN 0,0
CUI_RCJ-02X = drill 2 round: GND@1 -5.15,0; GND@2 5.15,0 | drill 1.7 round: PIN 0,1.6
OST_SCREWTERM_2.54MM_2POS = drill 1.3 square: 1 -1.27,0 | drill 1.3 round: 2 1.27,0
L-1206 = smd 1.27 x 1.651: A -1.397,0; B 1.397,0
MTG-4-40 = drill 3.264 pad 6.452 round: P$1 0,0
R-1206 = smd 1.27 x 1.651: A -1.397,0; B 1.397,0
TSSOP-14 = smd 0.35 x 1.6: 1 -1.95,-2.8; 2 -1.3,-2.8; 3 -0.65,-2.8; 4 0,-2.8; 5 0.65,-2.8; 6 1.3,-2.8; 7 1.95,-2.8; 8 1.95,2.8; 9 1.3,2.8; 10 0.65,2.8; 11 0,2.8; 12 -0.65,2.8; 13 -1.3,2.8; 14 -1.95,2.8
TSSOP-20 = smd 0.28 x 0.75: 1 -2.925,-3; 2 -2.275,-3; 3 -1.625,-3; 4 -0.975,-3; 5 -0.325,-3; 6 0.325,-3; 7 0.975,-3; 8 1.625,-3; 9 2.275,-3; 10 2.925,-3; 11 2.925,3; 12 2.275,3; 13 1.625,3; 14 0.975,3; 15 0.325,3; 16 -0.325,3; 17 -0.975,3; 18 -1.625,3; 19 -2.275,3; 20 -2.925,3
LFCSP-64 = smd 0.55 x 0.32: 1 -4.3,3.75; 2 -4.3,3.25; 3 -4.3,2.75; 4 -4.3,2.25; 5 -4.3,1.75; 6 -4.3,1.25; 7 -4.3,0.75; 8 -4.3,0.25; 9 -4.3,-0.25; 10 -4.3,-0.75; 11 -4.3,-1.25; 12 -4.3,-1.75; 13 -4.3,-2.25; 14 -4.3,-2.75; 15 -4.3,-3.25; 16 -4.3,-3.75; 33 4.3,-3.75; 34 4.3,-3.25; 35 4.3,-2.75; 36 4.3,-2.25; 37 4.3,-1.75; 38 4.3,-1.25; 39 4.3,-0.75; 40 4.3,-0.25; 41 4.3,0.25; 42 4.3,0.75; 43 4.3,1.25; 44 4.3,1.75; 45 4.3,2.25; 46 4.3,2.75; 47 4.3,3.25; 48 4.3,3.75 | smd 0.32 x 0.55: 17 -3.75,-4.3; 18 -3.25,-4.3; 19 -2.75,-4.3; 20 -2.25,-4.3; 21 -1.75,-4.3; 22 -1.25,-4.3; 23 -0.75,-4.3; 24 -0.25,-4.3; 25 0.25,-4.3; 26 0.75,-4.3; 27 1.25,-4.3; 28 1.75,-4.3; 29 2.25,-4.3; 30 2.75,-4.3; 31 3.25,-4.3; 32 3.75,-4.3; 49 3.75,4.3; 50 3.25,4.3; 51 2.75,4.3; 52 2.25,4.3; 53 1.75,4.3; 54 1.25,4.3; 55 0.75,4.3; 56 0.25,4.3; 57 -0.25,4.3; 58 -0.75,4.3; 59 -1.25,4.3; 60 -1.75,4.3; 61 -2.25,4.3; 62 -2.75,4.3; 63 -3.25,4.3; 64 -3.75,4.3 | smd 6.35 x 6.35: PAD 0,0
SOIC-8 = smd 1.5 x 0.53: 1 -2.494,1.871; 2 -2.494,0.624; 3 -2.494,-0.624; 4 -2.494,-1.871; 5 2.494,-1.871; 6 2.494,-0.624; 7 2.494,0.624; 8 2.494,1.871
LANTRONIX-XPORT = drill 0.9 round: 1 8.89,-3.81; 2 6.35,-2.54; 3 8.89,-1.27; 4 6.35,0; 5 8.89,1.27; 6 6.35,2.54; 7 8.89,3.81; 8 6.35,5.08 | drill 1.6 long: 'SHLD2 11.9,-8.025; SHLD1 11.9,8.025 | hole 3.25: 0,-6.15; 0,6.15
WDFN-12 = smd 0.27 x 0.6: 1 -1.225,-1.28; 2 -0.735,-1.28; 3 -0.245,-1.28; 4 0.245,-1.28; 5 0.735,-1.28; 6 1.225,-1.28; 7 1.225,1.28; 8 0.735,1.28; 9 0.245,1.28; 10 -0.245,1.28; 11 -0.735,1.28; 12 -1.225,1.28 | smd 2.5 x 1.65: PAD 0,0
DFN-14_SPLITPAD = smd 0.25 x 0.7: 1 -1.5,-1.4; 2 -1,-1.4; 3 -0.5,-1.4; 4 0,-1.4; 5 0.5,-1.4; 6 1,-1.4; 7 1.5,-1.4; 8 1.5,1.4; 9 1,1.4; 10 0.5,1.4; 11 0,1.4; 12 -0.5,1.4; 13 -1,1.4; 14 -1.5,1.4 | smd 1.78 x 1.65: GNDPAD -0.75,0 | smd 1.07 x 1.65: INN_PAD 1.125,0
SOT23-3 = smd 0.6 x 0.7: 1 -0.95,-1.05; 2 0.95,-1.05; 3 0,1.05
XTAL_ABRACON_ALBS = smd 5.588 x 2.108: A -4.75,0; B 4.75,0

### Placement (x,y rotation side)
C1  81.28,43.5 0 top
C2  43.18,39.37 180 top
C3  44.77,82.87 180 top
C4  57.47,90.33 90 top
C5  60.33,68.58 180 top
C6  50.48,59.05 270 top
C7  54.29,61.91 0 top
C8  7.62,81.44 90 top
C9  26.04,85.09 270 top
C10  51.75,74.61 270 top
C11  61.6,84.45 90 top
C12  61.91,80.64 270 top
C13  54.61,74.3 270 top
C14  44.77,81.28 180 top
C15  54.93,90.49 90 top
C16  64.45,80.64 90 top
C17  64.14,88.27 270 top
C18  43.18,38.1 180 top
C19  46.36,34.93 270 top
C20  42.23,41.59 90 top
C21  45.4,44.77 180 top
C22  55.56,41.91 90 top
C23  53.34,44.77 0 top
C24  55.88,36.51 270 top
C25  53.66,33.97 0 top
C26  69.21,44.77 180 top
C27  72.39,47.31 180 top
C28  69.21,42.23 180 top
C29  72.39,38.42 270 top
C30  81.28,42.23 0 top
C31  78.1,39.05 270 top
C32  81.28,44.77 0 top
C33  78.42,47.94 90 top
C34  39.05,60.96 180 top
C35  54.93,39.37 180 top
C36  69.21,43.5 0 top
C37  10.32,81.91 180 top
C38  23.18,84.77 0 top
C39  20,84.58 0 top
C40  13.49,81.91 180 top
C41  27.62,40.64 90 top
C42  33.02,43.82 270 top
C43  26.99,43.18 0 top
C44  31.43,46.99 270 top
C45  23.18,48.9 270 top
C46  33.34,48.26 0 top
C47  18.1,78.1 180 top
C48  15.56,87.79 0 top
C49  55.25,98.11 180 top
D1  25.08,17.46 270 top
D2  54.93,17.46 270 top
D3  42.86,17.46 270 top
D4  14.29,17.46 270 top
D5  23.81,66.04 270 top
D6  21.91,46.04 180 top
D7  18.1,32.07 90 top
J1  33.02,91.44 270 top
J2  14.29,9.21 0 top
J3  43.5,9.21 0 top
J4  25.72,9.21 0 top
J5  54.93,9.21 0 top
J6  8.57,67.63 0 top
J7  8.89,41.59 0 top
J8  8.89,27.62 0 top
J9  6.67,51.12 270 top
J10  6.67,17.46 270 top
J11  6.67,57.47 270 top
L1  13.34,77.79 180 top
L2  20.32,88.9 180 top
MH1  4.45,4.45 0 top
MH2  95.57,4.45 0 top
MH3  95.57,57.47 0 top
MH4  4.76,95.57 0 top
R1  40.32,85.41 180 top
R2  41.59,88.27 180 top
R3  42.55,85.41 270 top
R4  52.39,63.82 180 top
R5  44.77,67.94 270 top
R6  46.36,67.94 270 top
R7  57.15,70.8 0 top
R8  56.52,74.3 270 top
R9  52.39,65.09 180 top
R10  72.39,72.07 270 top
R11  70.8,66.67 180 top
R12  42.86,80.01 0 top
R13  42.86,77.47 0 top
R14  42.86,78.74 180 top
R15  50.8,69.53 180 top
R16  42.23,67.94 270 top
R17  43.5,67.94 270 top
R18  64.14,84.45 270 top
R19  51.44,89.85 180 top
R20  40.96,33.97 0 top
R21  44.13,34.93 90 top
R22  46.36,43.5 180 top
R23  43.5,41.59 270 top
R24  51.44,47.94 0 top
R25  54.29,41.91 270 top
R26  61.28,40.01 270 top
R27  54.61,36.51 90 top
R28  72.39,48.58 180 top
R29  69.85,47.31 270 top
R30  73.98,38.42 270 top
R31  71.12,38.42 90 top
R32  83.82,38.42 180 top
R33  80.33,39.05 90 top
R34  76.83,47.94 90 top
R35  80.33,47.94 270 top
R36  77.79,90.17 270 top
R37  73.34,62.55 270 bottom
R38  60.33,76.83 270 top
R39  15.56,86.2 180 top
R40  15.56,89.38 0 top
R41  18.1,79.53 0 top
R42  18.1,76.68 180 top
R43  52.39,66.36 180 top
R44  39.69,65.72 0 top
R45  39.69,64.45 0 top
R46  63.18,80.64 270 top
R47  58.42,93.66 180 top
U1  49.21,39.37 270 top
U2  75.56,43.5 90 top
U3  45.4,62.55 90 top
U4  54.61,82.55 270 top
U5  67.31,70.48 180 top
U6  88.58,93.66 270 top
U7  16.83,83.19 0 top
U8  28.26,46.99 0 top
U9  58.42,95.88 0 top
X1  69.98,85.22 90 top

### Tracks (layer width: path | path; a pad name or v marks a point on that pad's centre or on a via)
!RESET  (via drill 0.41)
  Top 0.254: U4.53 59.54,80.8 v60.01,80.33 | v59.05,91.44 59.05,93.54 R47.A | U6.6 91.12,97.16 89.85,98.43 60.64,98.43 v59.69,97.47
  Top 0.406: U9.2 59.37,93.66 R47.A
  Bottom 0.254: v60.01,80.33 59.05,81.28 v59.05,91.44 59.69,92.07 v59.69,97.47
!SPI1_FLASH_CS  (via drill 0.38)
  Top 0.254: U4.45 56.83,78.22 56.83,77.15 58.42,75.57 v58.42,74.61 | v67.94,69.53 68.86,68.61 U5.1 69.84,68.58 72.71,68.58 73.34,67.94 73.34,66.99 73.02,66.68 R11.A
  Route2 0.254: v58.42,74.61 58.42,70.17 59.05,69.53 v67.94,69.53
+1.2V  (via drill 0.38, 0.64)
  Top 0.254: U4.40 U4.41 54.86,76.77 v54.61,76.52 C13.A | U4.9 U4.8 54.86,88.2 v54.93,88.27 C15.A | U4.55 60.53,81.8 v60.64,81.91 | U4.26 47.19,81.8 v46.99,81.6 46.67,81.28 C14.A | 24.77,85.88 24.61,85.73 24.61,80.17 23.97,79.53 R41.B C47.A
  Top 0.406: C12.A 61.15,81.41 v60.64,81.91
  other vias: 23.81,89.85 23.81,88.08 26.12,89.85 26.12,88.08
  pour Route15: 4.13,99.38 62.55,99.38 62.55,72.71 4.13,72.71
  pour Top: 20.95,90.8 20.95,87.63 21.59,87.63 21.59,85.57 27.15,85.57 27.15,90.8
+3.3V  (via drill 0.38, 0.41, 0.64)
  Top 0.254: U4.25 47.24,82.3 46.67,82.87 C3.A 45.72,83.06 v45.72,84.14 | C10.A v51.75,76.83 51.86,76.94 U4.35 | C5.A v62.86,68.58 64.78,68.58 U5.8 64.85,68.58 66.36,68.58 66.68,68.9 66.68,70.8 66.98,71.11 U5.3 | U4.3 57.36,88.16 v57.47,88.27 C4.A | U4.14 51.86,88.16 v51.43,88.58 | U4.58 60.12,83.3 v60.33,83.5 | U4.46 57.36,77.9 v58.1,77.15 | v40.64,78.74 R14.B | R39.B C48.A | R39.B | R39.B 9.37,86.2 8.57,85.41 8.57,80.49 | U3.6 49.52,62.87 49.85,62.55 49.85,62.22 | v37.47,65.72 R44.A | v37.47,64.45 R45.A | R11.B 68.9,66.68 68.58,66.99 v68.26,66.99 | R47.B 56.51,93.66 v56.2,93.35
  Top 0.305: U3.5 49.85,62.22 53.46,62.22 C7.A 53.34,61.79 v53.34,60.64 | R2.B 40.64,88.27 v40.64,89.54 | v42.54,83.19 R3.B
  Top 0.381: R38.B v60.33,74.61
  Top 0.406: C11.A 60.52,83.69 v60.33,83.5 | U9.3 v58.42,98.11 C49.A
  other vias: 9.68,78.26 9.68,76.99 7.78,78.26 7.78,76.99
  pour Route2: 4.76,99.06 98.11,99.38 98.11,61.28 57.47,61.28 57.47,57.47 52.39,57.47 52.39,61.28 4.76,61.28
  pour Top: 13.02,79.06 13.02,76.04 6.67,76.04 6.67,81.12 11.59,81.12 11.59,79.06
+5VA  (via drill 0.38)
  Top 0.254: C43.A 26.35,43.31 26.35,44.13 26.76,44.54 U8.1
  Top 0.305: C1.A U2.4 v76.83,43.5 | U3.4 48.43,61.6 50.16,61.6 v50.48,61.28 C6.A | C2.A U1.4 v47.94,39.37
  Top 0.406: v24.45,40.64 C41.P 26.23,40.69 C43.A
  pour Route15: 87.31,61.91 13.65,61.91 13.65,20.95 87.31,20.95
+VA_IN  (via drill 0.38)
  Top 0.254: U8.10 28.76,49.4 v29.21,49.85 | U8.14 26.67,48.48 v26.67,49.53 27.31,49.53 27.76,49.08 U8.12
  Top 0.305: 24.51,48.91 C45.P
  Top 0.61: 24.51,48.91 24.51,49.53 v26.67,49.53
  Top 0.813: 24.51,48.91 24.45,48.84 24.45,46.04 D6.K
  Route2 0.254: v26.67,49.53 28.89,49.53 v29.21,49.85
-5VA  (via drill 0.38)
  Top 0.254: v29.84,43.82 29.76,43.82 U8.7 29.76,45.72 30.48,45.72 30.8,46.04 31.24,46.04 C44.B
  Top 0.305: C36.B U2.11 v74.3,43.5 | C35.B U1.11 v50.48,39.37
  Top 0.406: v29.84,43.82 C42.N
  pour Route2: 87.31,60.64 58.1,60.64 58.1,56.83 51.75,56.83 51.75,60.64 13.65,60.64 13.65,20.95 87.31,20.95
-VA_IN
  Top 0.254: C46.N arc90 33.26,46.99 29.53,46.99 29.46,46.91 U8.INN_PAD 29.26,46.99 | 29.26,46.99 U8.9 | 29.26,46.99 U8.6
  Top 0.813: C46.N 33.34,45.08 33.02,44.77 33.02,40.01 30.8,37.78 19.37,37.78 18.1,36.51 D7.A
AGND  (via drill 0.38)
  Top 0.254: v28.58,44.45 28.26,44.77 U8.4 U8.5 | 47.65,63.52 U3.7 | 47.65,63.52 47.31,63.18 v47.31,60.96 | R43.A R9.A 53.15,66.87 52.71,67.31 48.26,67.31 47.62,66.68 47.65,66.65 47.65,63.52 | U8.GNDPAD v27.62,46.99
  Top 0.305: C32.B v83.5,44.77 | C1.B v83.5,43.5 | C30.B v83.5,42.23 | C26.B v66.99,44.77 | C36.A v66.99,43.5 | C28.B v66.99,42.23 | U3.3 47.35,60.92 v47.31,60.96 | C6.B v50.48,56.51 | C34.B v36.51,60.96 | C35.A v57.15,39.37 | C24.B v55.88,34.29 | C22.B v55.56,44.13 | C18.B v40.96,38.1 | C2.B v40.96,39.37 | C20.B v42.23,43.82
  Top 0.406: C42.P v36.19,43.82 | v20,48.9 C45.N | C41.N v30.8,40.64 | v53.34,17.46 D2.2 | D3.2 v41.28,17.46 | D1.2 v23.65,17.46 | v12.86,17.46 D4.2
  Top 0.61: C46.P v33.34,51.43
  pour Bottom: 1.59,53.98 13.65,53.98 13.65,61.91 99.38,61.91 99.38,0.95 1.59,0.95
CH1_IN
  Top 0.305: U2.13 U2.14 72.39,41.55 C29.A 72.39,38.42 65.41,38.42 63.5,40.32 63.5,52.71 62.86,53.34 49.21,53.34 46.99,55.56 46.99,59.69 47.57,60.27 U3.2
CH1_OUT
  Top 0.305: R20.A 38.73,33.97 37.78,34.93 37.78,57.47 40.64,60.01 40.9,60.27 U3.19
CH2_IN
  Top 0.305: U2.6 U2.7 78.42,45.51 C33.A 78.42,47.94 75.25,47.94 74.93,48.26 74.93,53.34 72.07,56.2 53.02,56.2 52.07,55.25 49.53,55.25 48.4,56.37 U3.1
CH2_OUT
  Top 0.305: R24.A 43.82,47.94 42.23,49.53 42.23,59.45 U3.20
CODEC_MCLK  (via drill 0.6)
  Top 0.254: R46.B 63.18,79.06 62.86,78.74 62.86,74.61 63.5,73.98 73.98,73.98 74.93,73.02 74.93,58.74 73.66,57.47 v59.69,57.47 | v36.19,57.47 33.34,57.47 32.7,58.1 32.7,61.91 33.66,62.87 U3.15
  Bottom 0.254: v36.19,57.47 v59.69,57.47
CODEC_REF
  Top 0.305: C34.A 39.85,60.92 U3.18
GND  (via drill 0.38, 0.6, 0.64)
  Top 0.254: C13.B v54.61,72.07 | C10.B v51.75,72.39 | C5.B 59.5,68.52 v57.79,68.52 | U4.30 49.32,79.8 v48.9,79.38 | v42.54,81.28 C14.B C3.B | v40.64,80.01 R12.A | v40.64,77.47 R13.A | C4.B v57.47,92.39 | C15.B v54.93,92.71 | C8.B v7.62,83.5 | v26.04,83.03 C9.B | v55.25,63.5 55.25,61.72 C7.B | v61.6,78.42 61.6,79.06 61.91,79.38 C12.B | U4.52 55.88,80.3 v55.88,81.28
  Top 0.305: U5.4 69.77,72.39 v67.94,72.39
  Top 0.406: U9.1 57.47,94.93 56.2,94.93 v55.88,94.61 | v53.02,98.11 C49.B
  Top 0.813: U4.PAD v55.88,83.82
  other vias: 53.34,81.28 53.34,83.82 77.79,79.06 77.79,75.25 77.79,72.07 77.79,68.26 81.6,68.26 85.41,68.26 89.22,68.26 92.39,68.26 96.2,68.26 98.74,68.26 98.74,72.07 98.74,75.25 98.74,79.69 64.14,76.2 66.67,76.2 69.21,76.2 71.75,76.2 74.3,76.2 74.3,78.74 74.3,81.28 74.3,83.82 74.3,86.36 74.3,88.9 74.3,91.44 74.3,94.14 71.75,94.14 69.21,94.14 66.67,94.14 64.14,94.14 61.6,94.3 61.6,91.44 61.6,88.9 61.6,86.52 12.7,89.38 16.83,83.19 20.48,76.52 21.91,76.52 21.91,74.93 20.48,74.93 19.05,74.93 17.62,74.93 17.62,73.5 19.05,73.5 20.48,73.5 21.91,73.5 10.95,89.38 9.21,89.38 9.21,91.76 10.95,91.76 12.7,91.76 14.45,91.76 16.19,91.76
  pour Bottom: 1.59,99.38 99.38,99.38 99.38,63.18 12.38,63.18 12.38,54.93 1.59,54.93
  pour Top: 76.52,82.23 100.01,82.23 100.01,66.99 76.52,66.99
  pour Top: 74.93,75.56 74.93,94.61 60.96,94.61 60.96,80.64 63.5,80.64 63.5,75.56
  pour Top: 23.81,84.14 9.05,84.14 9.05,81.91 11.27,81.91 11.27,82.55 18.73,82.55 18.73,80.33 23.65,80.33 23.81,80.49
  pour Top: 17.14,84.45 17.14,92.39 8.41,92.39 8.41,88.74 15.4,88.74 15.4,90.01 16.99,90.01 16.99,84.45
  pour Top: 16.51,81.91 16.51,72.71 22.7,72.71 22.7,77.31 18.1,77.31 18.1,75.88 16.67,75.88 16.67,81.91
N$1
  Top 0.254: U4.19 49.64,85.3 49.21,85.72 49.21,86.99 48.26,87.95 42.54,87.95 42.35,88.14 R2.A
  Top 0.305: R2.A 42.35,91 41.59,91.76 33.34,91.76 J1.2
N$2  (via drill 0.38)
  Top 0.254: U4.21 49.05,84.3 47.62,85.72 v47.62,86.04
  Route2 0.305: v47.62,86.04 47.31,85.72 37.15,85.72 36.51,86.36 J1.6
N$3  (via drill 0.38)
  Top 0.254: U4.24 47.69,82.8 v47.31,83.19
  Route2 0.254: 41.59,82.23 42.86,82.23 43.5,82.87 46.99,82.87 v47.31,83.19
  Route2 0.305: 41.59,82.23 40.01,83.82 J1.8
N$4
  Top 0.254: U4.20 49.18,84.8 48.58,85.41 48.58,86.68 47.94,87.31 34.61,87.31 34.29,87.63 32.39,87.63 31.75,86.99 31.75,81.91 32.39,81.28 J1.10
N$5
  Top 0.254: U4.22 48.6,83.8 46.36,86.04 42.67,86.04 R3.A 42.35,86.36 36.51,86.36 35.24,85.09 35.24,79.38 34.61,78.74 J1.12
N$6
  Top 0.305: R1.B 38.73,85.41 36.19,82.87 36.19,77.15 35.24,76.2 J1.14
N$7
  Top 0.254: U4.23 48.15,83.3 46.04,85.41 R1.A
N$8
  Top 0.254: R16.B 42.23,66.36 42.54,66.04 44.77,66.04 | 44.77,66.04 R5.B | 42.4,62.23 44.13,62.23 44.77,62.86 44.77,66.04
  Top 0.305: U3.16 42.4,62.23
N$9
  Top 0.254: U3.14 42.38,63.5 40.01,63.5 39.69,63.82 39.69,66.36 41.28,67.94 43.5,67.94 | 43.5,67.94 R17.B | R6.B 46.36,67.94 43.5,67.94
N$10
  Top 0.254: R4.B 50.48,63.82 50.13,64.17 U3.8
N$11
  Top 0.254: U4.42 55.36,72.59 56.2,71.76 56.2,70.99 R7.A
N$12
  Top 0.254: R8.A 56.51,75.88 55.86,76.54 U4.43
N$13
  Top 0.254: U3.9 50.22,64.82 50.48,65.09 R9.B
N$14
  Top 0.254: U4.27 47.65,81.3 46.36,80.01 R12.B
N$15
  Top 0.254: U5.2 72.08,69.86 72.39,70.17 R10.B
N$16
  Top 0.254: U3.10 48.96,65.47 49.85,66.36 R43.B
N$17
  Top 0.254: U3.12 41.33,64.82 40.96,64.45 R45.B
N$18
  Top 0.254: U4.37 52.86,70.01 52.39,69.53 R15.A
N$19
  Top 0.305: C19.A 46.41,35.74 U1.7 U1.6 46.44,38.1 48.26,38.1 48.9,38.73 48.9,40.32 48.58,40.64 47.94,40.64 47.62,40.96 47.62,42.23 47.31,42.54 47.31,43.31 R22.A
N$20
  Top 0.305: U1.5 45.42,38.72 45.4,38.73 44.77,38.1 C18.A 43.94,35.88 R21.B
N$21
  Top 0.305: C19.B R21.A 41.91,34.16 R20.B
N$22
  Top 0.254: U4.62 59.9,85.3 60.33,85.72 60.33,87.31 60.64,87.63 64.01,87.63 C17.B
  Top 0.406: R18.A C17.B 69.72,87.5 69.85,87.63 69.85,89.84 X1.B
N$23  (via drill 0.38)
  Top 0.254: U1.1 46.36,41.38 46.36,44.58 C21.A
  Top 0.305: U1.2 U1.1 46.37,41.28 44.77,41.28 44.45,41.59 39.37,41.59 38.73,40.96 v38.73,40.64 | D1.1 25.4,29.53 26.67,30.8 33.65,30.8 34.93,32.07 v34.93,40.64
  Top 0.406: J4.PIN 25.4,9.52 D1.1
  Route2 0.305: v34.93,40.64 v38.73,40.64
N$24
  Top 0.813: J6.PIN 8.57,65.56 9.21,64.93 10.48,64.93 | 10.48,64.93 23.34,64.93 23.34,65.02 D5.A | J11.1 9.21,58.74 10.48,60.01 10.48,64.93
N$25
  Top 0.254: U4.61 60.3,84.8 60.64,84.46 62.55,84.46 63.31,83.69 R18.B
  Top 0.406: R18.B 64.14,82.55 64.45,82.23 C16.B 69.04,81.41 X1.A
N$26
  Top 0.305: U1.3 45.07,40.02 44.45,40.64 43.69,40.64 R23.B C20.A
N$27
  Top 0.254: U4.13 52.36,89.69 R19.A
N$28
  Top 0.305: C21.B 43.82,44.77 43.5,44.45 R23.A 44.89,42.35 45.4,42.86 45.4,43.31 R22.B
N$29
  Top 0.305: R25.A 54.29,44.58 C23.B 54.1,47.18 53.34,47.94 R24.B
N$30
  Top 0.305: C23.A 52.58,42.74 52.07,42.23 52.07,41.38 U1.14 | U1.13 U1.14 | R26.A 61.09,40.96 59.37,40.96 58.42,41.91 53.34,41.91 52.75,41.32 U1.14
N$31
  Top 0.305: 52.03,40.01 U1.12 53.04,40.02 53.34,40.32 53.34,40.64 53.85,41.15 R25.B C22.A
N$32
  Top 0.305: R27.A 54.42,35.56 C25.B 54.42,33.53 54.93,33.02 59.69,33.02 61.28,34.61 R26.B
N$33
  Top 0.305: C24.A R27.B 54.61,38.1 54.29,38.42 53.34,38.42 53.02,38.73 52.03,38.73 U1.10
N$34
  Top 0.305: U1.9 U1.8 52.01,34.86 C25.A 52.9,25.53 55.25,23.18 D2.1
  Top 0.406: J5.PIN 55.25,9.52 D2.1
N$35
  Top 0.254: U4.54 58.93,81.28 60.33,81.28 60.96,80.65 60.96,79.69 60.33,79.06 R38.A
N$36
  Top 0.305: C27.A 73.15,45.45 U2.8 U2.9 74.58,44.8 75.25,44.13 75.25,42.86 73.98,41.59 R30.A
N$37
  Top 0.305: U2.10 72.75,44.13 71.76,44.13 71.12,44.77 C26.A 69.85,44.77 R29.B
N$38
  Top 0.305: C27.B R28.B 70.8,48.58 70.49,48.26 70.04,48.26 R29.A
N$39
  Top 0.305: U2.12 72.75,42.86 71.76,42.86 71.12,42.23 C28.A 69.85,42.1 69.85,39.69 70.36,39.18 R31.B
N$40
  Top 0.305: R31.A C29.B R30.B
N$41
  Top 0.305: U6.4 88.58,88.9 87.95,89.54 77.79,89.54 R36.B
N$42
  Top 0.305: C31.B R33.A 83.06,38.29 R32.B
N$43
  Top 0.305: C31.A 78.1,41.55 U2.1 U2.2 76.86,42.2 75.88,43.18 75.88,44.45 76.83,45.4 R34.A
N$44
  Top 0.305: R33.B 80.52,39.81 C30.A 80.01,42.23 79.39,42.85 U2.3
N$45
  Top 0.305: R35.A C33.B R34.B
N$46
  Top 0.254: U7.4 17.07,79.59 R41.A C47.B R42.B
N$47
  Top 0.305: R35.B 80.52,46.99 C32.A 80.2,44.45 79.69,44.45 79.39,44.15 U2.5
N$48
  Top 0.254: U7.10 16.58,85.94 R39.A C48.B | C48.B | C48.B R40.B | R40.B
N$49
  pour Top: 16.1,82.07 16.1,76.52 13.65,76.52 13.65,79.06 16.03,79.06 16.03,82.07
N$50  (via drill 0.38)
  Top 0.305: R28.A 73.15,50.61 v73.34,50.8 | v17.46,18.73 16.83,18.73 15.56,17.46 D4.1
  Top 0.406: J2.PIN 14.6,9.52 D4.1
  Route15 0.305: v72.07,49.85 v73.34,50.8 | v72.71,19.68 71.76,18.73 v17.46,18.73
  Bottom 0.305: v72.71,19.68 72.71,48.9 72.07,49.53 v72.07,49.85
N$51
  Top 0.305: R32.A 84.58,6.79 80.96,3.17 45.08,3.17 43.5,4.76 J3.PIN
  Top 0.406: J3.PIN 43.18,9.52 D3.1
N$52
  Top 0.254: U3.11 41.21,65.47 40.96,65.72 R44.B
N$53
  Top 0.254: U8.11 28.26,50.48 28.58,50.8 31.11,50.8 31.43,50.48 C44.A
N$54
  pour Top (no thermals): 17.56,84.3 17.56,90.65 20,90.65 20,87.63 17.62,87.63 17.62,84.3
N$55
  Top 0.254: C43.B 27.62,43.31 27.62,44.77 27.76,44.9 U8.3
N$56
  Top 0.813: J7.PIN 11.74,46.04 | 11.74,46.04 D6.A | J9.1 10.48,52.39 11.75,51.12 11.75,46.05 11.74,46.04
N$57
  Top 0.813: D7.K 10.4,30.73 J8.PIN 9.21,28.9 9.21,24.45 6.67,21.91 J10.1
N$58
  Top 0.254: U4.57 60.71,82.8 60.96,82.55 62.86,82.55 63.18,82.23 R46.A
RMT_BMODE0  (via drill 0.38)
  Top 0.254: U4.29 48.55,80.3 45.72,77.47 R13.B | R13.B 43.5,77.34 | v39.69,67.63 39.69,68.26 40.32,68.9 40.32,72.71 41.28,73.66 42.86,73.66 43.62,74.42 R13.B
  Route15 0.254: U6.7 93.35,83.82 93.35,66.68 92.07,65.41 45.4,65.41 42.54,67.63 v39.69,67.63
RMT_BMODE1  (via drill 0.38)
  Top 0.254: R14.A v44.77,78.74 46.04,78.74 48.1,80.8 U4.28
  Route15 0.254: U6.8 92.39,86.04 91.76,86.04 91.12,85.41 91.12,67.63 89.54,66.04 52.39,66.04 52.07,66.36 51.43,66.36 51.12,66.04 47.62,66.04 44.77,68.58 v44.77,78.74
SPI1_MISO
  Top 0.254: U4.44 56.36,76.67 57.47,75.57 57.47,73.98 58.1,73.34 71.12,73.34 71.44,73.02 72.2,73.02 R10.A
SPI1_MOSI
  Top 0.254: U5.5 64.78,72.39 63.5,72.39 62.86,71.76 57.15,71.76 56.51,72.39 R8.B
SPI1_SCK
  Top 0.254: R7.B 63.18,70.8 63.5,71.12 64.8,71.12 U5.6
SPORT0_RX_CLK
  Top 0.254: U4.33 50.72,78.1 50.16,78.1 42.23,70.17 R16.A
SPORT0_RX_DATA  (via drill 0.38)
  Top 0.254: U4.32 49.59,78.8 v48.58,77.79 | R4.A 54.29,63.82 54.93,64.45 54.93,66.99 v54.61,67.31
  Route2 0.254: v48.58,77.79 48.58,68.26 49.53,67.31 v54.61,67.31
SPORT0_RX_FS
  Top 0.254: R17.A 43.5,69.53 50.8,76.83 50.8,77.15 51.36,77.71 U4.34
SPORT0_TX_CLK
  Top 0.254: U4.38 53.36,69.55 52.39,68.58 51.12,68.58 50.8,68.9 50.8,70.49 50.48,70.8 46.04,70.8 44.77,69.53 R5.A
SPORT0_TX_DATA  (via drill 0.38)
  Top 0.254: U3.13 43.46,64.17 v43.5,64.14 | v47.62,69.53 R15.B
  Route2 0.254: v43.5,64.14 46.36,64.14 47.62,65.41 v47.62,69.53
SPORT0_TX_FS
  Top 0.254: U4.39 53.86,68.46 53.34,67.94 49.21,67.94 48.58,68.58 46.48,68.58 R6.A
UART0_RX
  Top 0.254: U4.15 51.36,87.39 48.26,90.49 48.26,95.25 49.21,96.2 76.2,96.2 77.79,94.61 R36.A
UART0_TX
  Top 0.254: R19.B 50.8,89.98 50.8,94.61 51.75,95.57 75.25,95.57 76.2,94.61 76.2,85.72 76.83,85.09 81.91,85.09 83.82,83.19 89.22,83.19 89.85,83.82 U6.5
VIN  (via drill 0.38, 0.64)
  Top 0.254: U7.1 14.13,81.91 v14.13,80.96 | U7.6 18.05,80.96 v18.1,80.96 | U7.12 15.6,85.25 v15.56,85.25
  Top 0.813: D5.K v23.81,71.6 14.13,71.6 v14.13,75.09
  Bottom 0.254: v14.13,80.96 v18.1,80.96 | v15.56,85.25 15.56,86.04 v20,86.04
  Bottom 0.813: v23.81,71.6 23.81,86.04 v20,86.04 | v14.13,75.09 v14.13,80.96
  pour Top (no thermals): 18,84.39 18,87.15 21.11,87.15 21.11,85.03 18.1,85.09 18.1,84.39
  pour Top (no thermals): 15.56,81.91 15.56,79.69 12.54,79.69 12.54,82.07 15.56,82.07

### Text on the board
tPlace: DEBUGGER | JTAG | DIGITAL POS | ANALOG POS | +/-5V DSP PID CONTROLLER | 2018 UWATERLOO/IQC | ANALOG NEG | SENKO TRAPPED ION GROUP | REV B 3/2018 (RWR) | S/N | CH1 IN | CH1 OUT | CH2 IN | CH2 OUT